# EAGLE schematic negatif voltage (EAGLE 9.6.2)
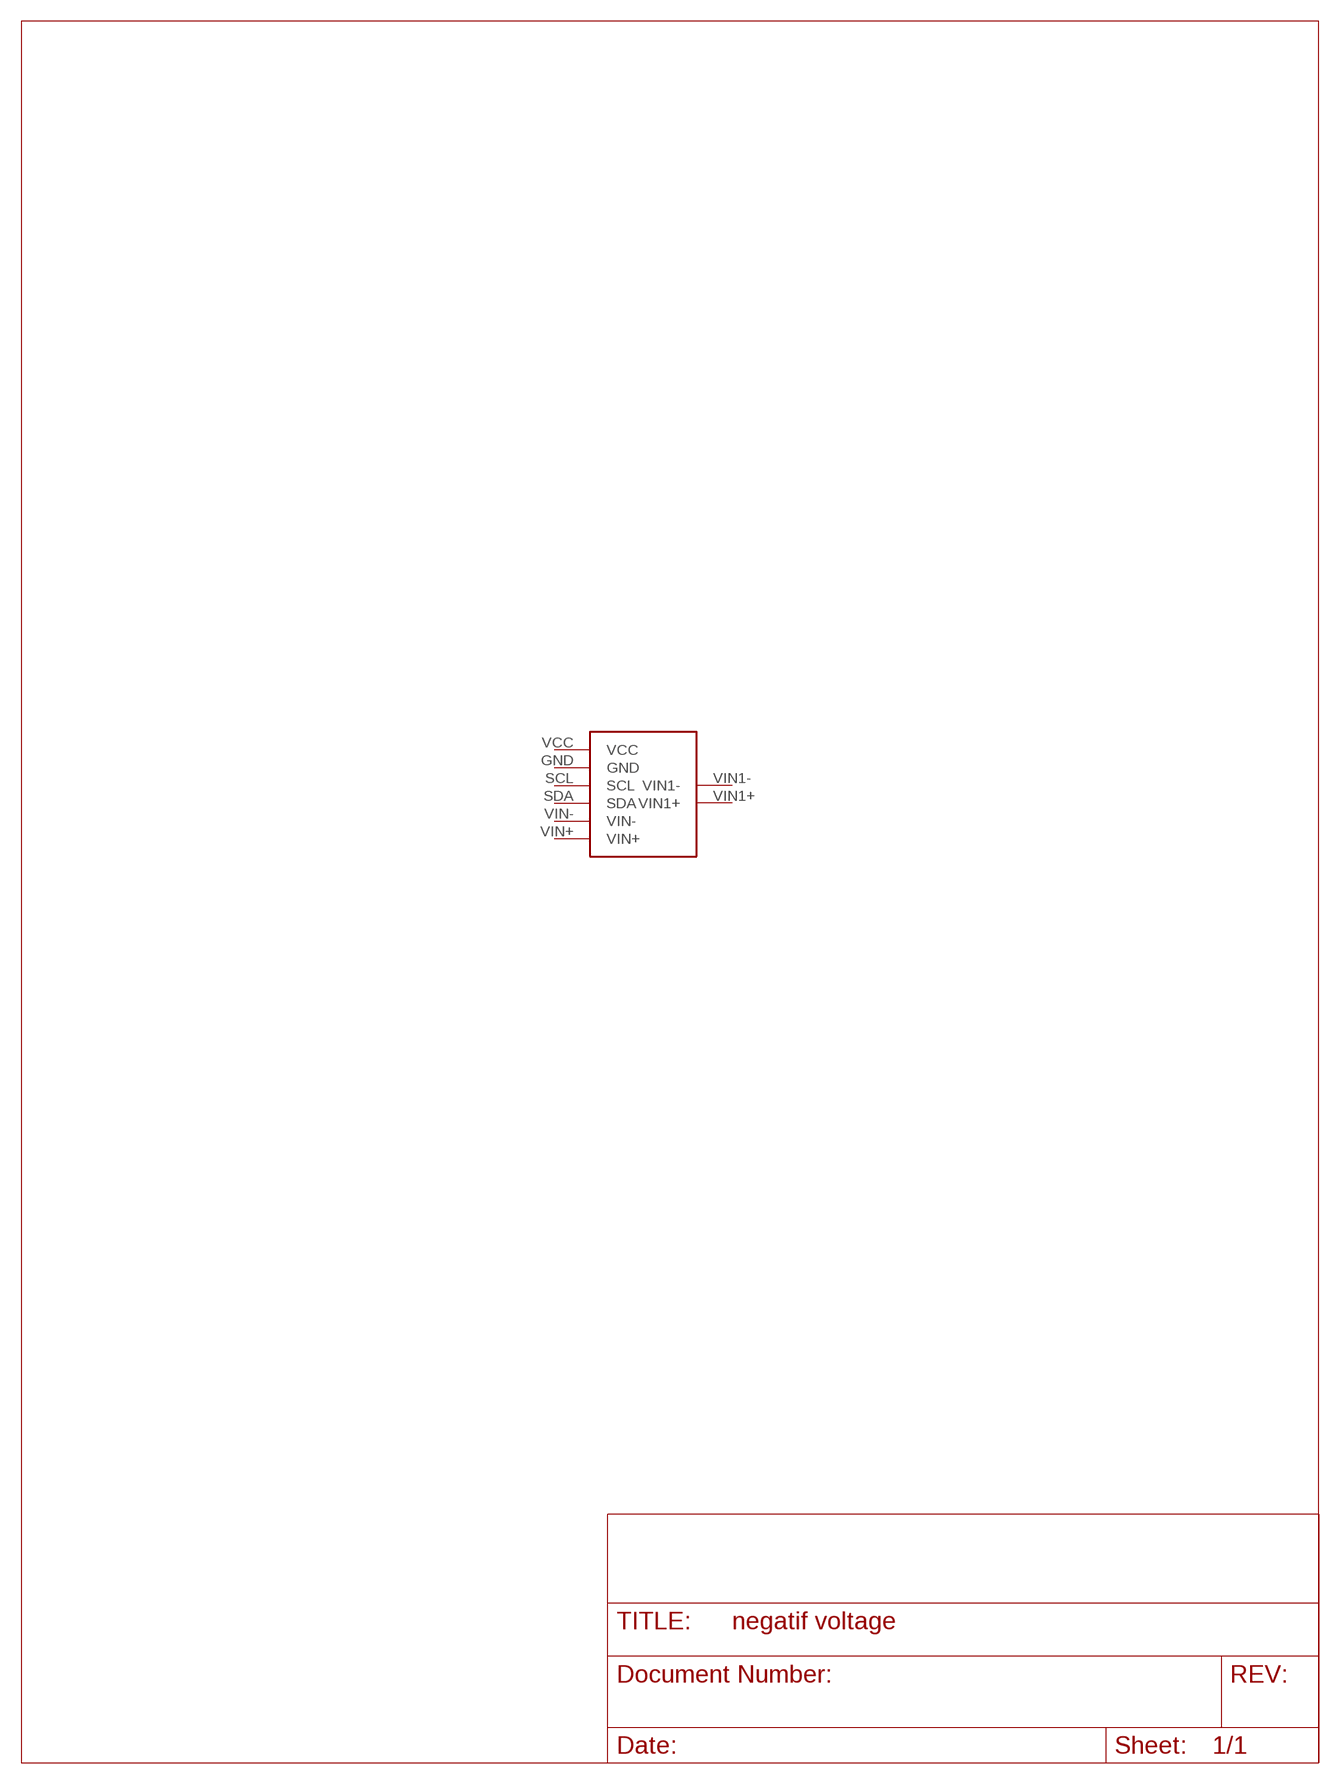
[diagram p0: schematic, sheet 1]

## Parts
INA1  INA219  [INA219]
Unconnected: INA1.GND INA1.SCL INA1.SDA INA1.VCC INA1.VIN1+ INA1.VIN1- INA1.VIN+ INA1.VIN-

## Library data of the parts
INA1 = ina219:INA219